# EAGLE schematic dacLayerBoard3 (EAGLE 6.1)
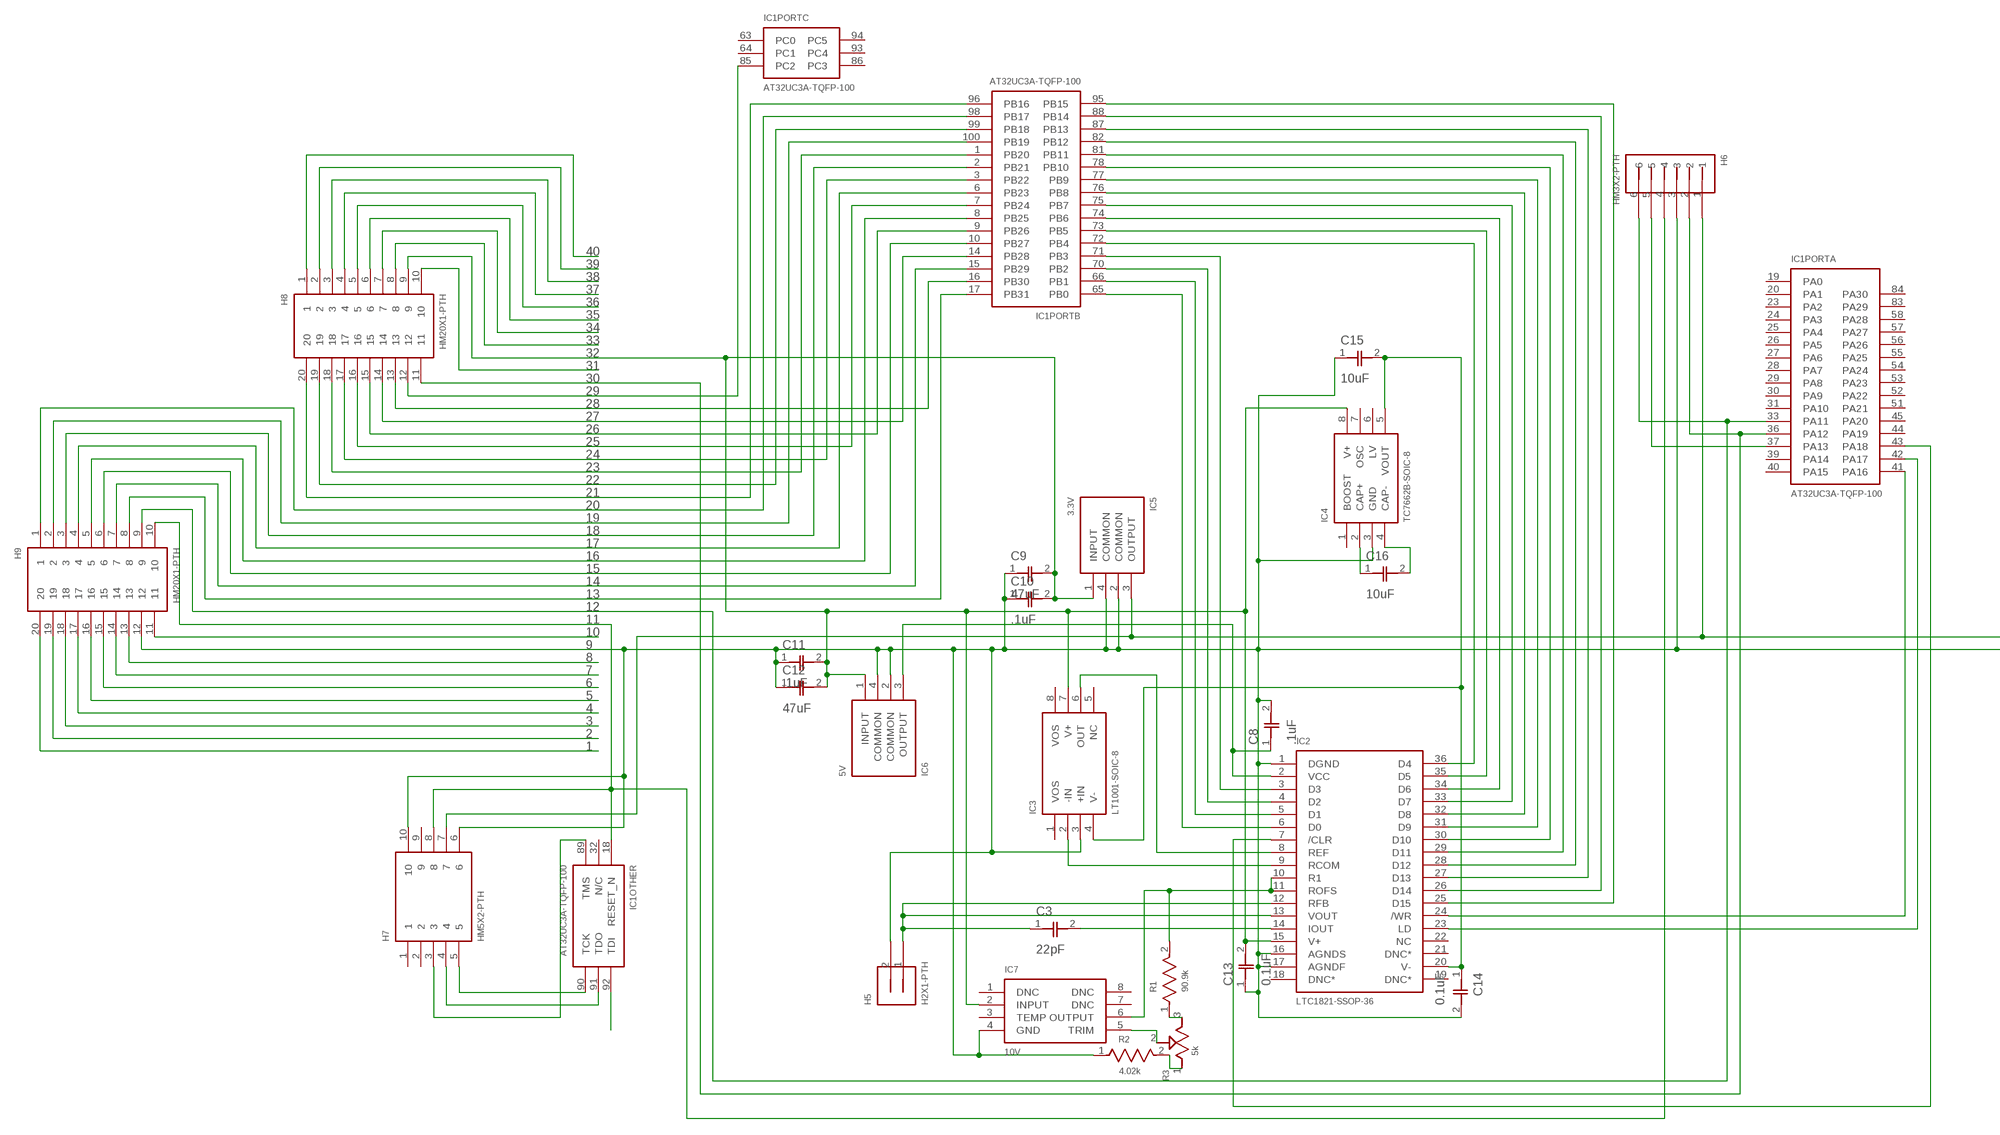
[diagram p0: schematic, sheet 1, part 1 of 2]
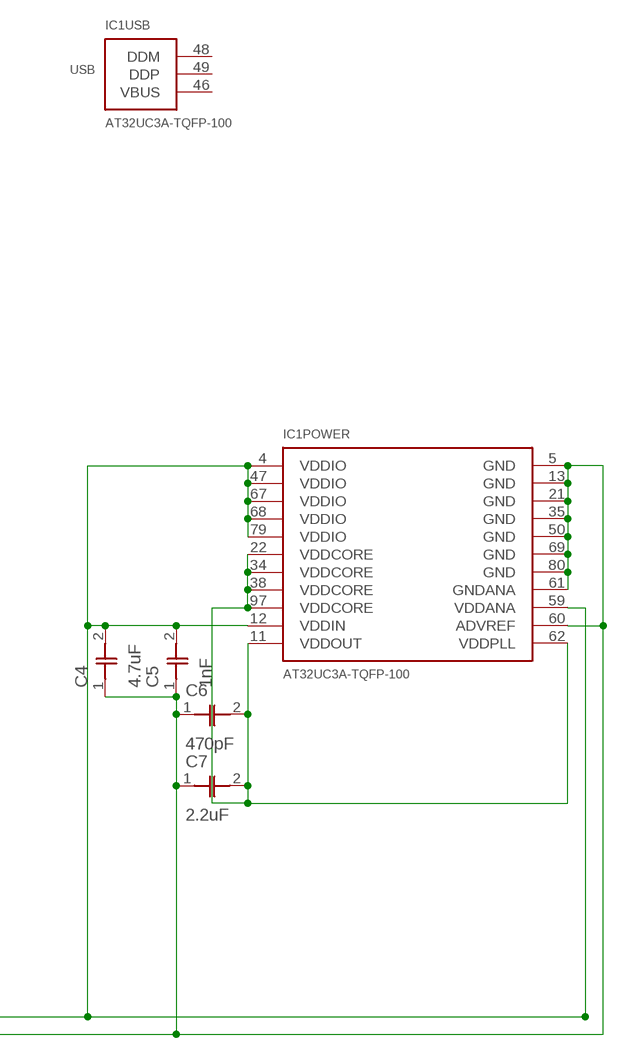
[diagram p1: schematic, sheet 1, part 2 of 2]

## Parts
C3  22pF  CAP-0603  [CAP-0603]
C4  4.7uF  CAP-0603  [CAP-0603]
C5  1nF  CAP-0603  [CAP-0603]
C6  470pF  CAP-0603  [CAP-0603]
C7  2.2uF  CAP-0603  [CAP-0603]
C8  .1uF  CAP-0603  [CAP-0603]
C9  47uF  CAP-0603  [CAP-0603]
C10  .1uF  CAP-0603  [CAP-0603]
C11  .1uF  CAP-0603  [CAP-0603]
C12  47uF  CAP-0603  [CAP-0603]
C13  0.1uF  CAP-0603  [CAP-0603]
C14  0.1uF  CAP-0603  [CAP-0603]
C15  10uF  CAP-0805  [0805]
C16  10uF  CAP-0805  [0805]
H5  H2X1-PTH  [HM2X1-PTH]
H6  HM3X2-PTH  [HM3X2-PTH]
H7  HM5X2-PTH  [HM5X2-PTH]
H8  HM20X1-PTH  [HM20X1-PTH]
H9  HM20X1-PTH  [HM20X1-PTH]
IC1  AT32UC3A-TQFP-100  [TQFP-100]
IC2  LTC1821-SSOP-36  [SSOP-36]
IC3  LT1001-SOIC-8  [SOIC-8]
IC4  TC7662B-SOIC-8  [SOIC-8]
IC5  3.3V  UA78M-SOT-223-4  [SOT-223-4]
IC6  5V  UA78M-SOT-223-4  [SOT-223-4]
IC7  10V  LT1019-SOIC-8  [SOIC-8]
R1  90.9k  RESISTOR-0603  [RES-0603]
R2  4.02k  RESISTOR-0603  [RES-0603]
R3  5k  TRIMPOT-3303W  [3303W]

## Nets
1: H9.20
2: H9.19
3: H9.18
4: H9.17
5: H9.16
6: H9.15
7: H9.14
8: H9.13
9: C4.1 C5.1 C6.1 C7.1 C8.2 C9.1 C10.1 C11.1 C12.1 C13.1 C14.2 C15.1 H5.2 H6.3 H7.6 H7.10 H9.12 IC1.5(POWER:GND) IC1.13(POWER:GND) IC1.21(POWER:GND) IC1.35(POWER:GND) IC1.50(POWER:GND) IC1.60(POWER:ADVREF) IC1.61(POWER:GNDANA) IC1.69(POWER:GND) IC1.80(POWER:GND) IC2.1(DGND) IC2.16(AGNDS) IC2.17(AGNDF) IC3.3(+IN) IC4.3(GND) IC5.2(COMMON) IC5.4(COMMON) IC6.2(COMMON) IC6.4(COMMON) IC7.4(GND) R2.1
10: H9.11
11: H6.4 H7.8 H9.10 IC1.18(OTHER:RESET_N)
12: H6.6 H9.9 IC1.33(PORTA:PA11)
13: H9.8 IC1.17(PORTB:PB31)
14: H9.7 IC1.15(PORTB:PB29)
15: H9.6 IC1.10(PORTB:PB27)
16: H9.5 IC1.8(PORTB:PB25)
17: H9.4 IC1.6(PORTB:PB23)
18: H9.3 IC1.2(PORTB:PB21)
19: H9.2 IC1.100(PORTB:PB19)
20: H9.1 IC1.98(PORTB:PB17)
21: H8.20 IC1.96(PORTB:PB16)
22: H8.19 IC1.99(PORTB:PB18)
23: H8.18 IC1.1(PORTB:PB20)
24: H8.17 IC1.3(PORTB:PB22)
25: H8.16 IC1.7(PORTB:PB24)
26: H8.15 IC1.9(PORTB:PB26)
27: H8.14 IC1.14(PORTB:PB28)
28: H8.13 IC1.16(PORTB:PB30)
29: H8.12 IC1.85(PORTC:PC2)
30: H6.2 H8.11 IC1.36(PORTA:PA12)
31: H8.10
32: C9.2 C10.2 C11.2 C12.2 C13.2 H8.9 IC2.15(V+) IC3.7(V+) IC4.8(V+) IC5.1(INPUT) IC6.1(INPUT) IC7.2(INPUT)
33: H8.8
34: H8.7
35: H8.6
36: H8.5
37: H8.4
38: H8.3
39: H8.2
40: H8.1
N$1: IC2.9(RCOM) IC3.2(-IN)
N$2: C8.1 IC2.2(VCC) IC6.3(OUTPUT)
N$3: IC2.8(REF) IC3.6(OUT)
N$4: C3.1 H5.1 IC2.12(RFB) IC2.13(VOUT)
N$5: C3.2 IC2.14(IOUT)
N$6: C16.1 IC4.2(CAP+)
N$7: C16.2 IC4.4(CAP-)
N$8: C4.2 C5.2 H6.1 H7.7 IC1.4(POWER:VDDIO) IC1.12(POWER:VDDIN) IC1.47(POWER:VDDIO) IC1.59(POWER:VDDANA) IC1.67(POWER:VDDIO) IC1.68(POWER:VDDIO) IC1.79(POWER:VDDIO) IC5.3(OUTPUT)
N$9: C6.2 C7.2 IC1.11(POWER:VDDOUT) IC1.22(POWER:VDDCORE) IC1.34(POWER:VDDCORE) IC1.38(POWER:VDDCORE) IC1.62(POWER:VDDPLL) IC1.97(POWER:VDDCORE)
N$10: C14.1 C15.2 IC2.20(V-) IC3.4(V-) IC4.5(VOUT)
N$11: IC1.65(PORTB:PB0) IC2.6(D0)
N$12: IC1.66(PORTB:PB1) IC2.5(D1)
N$13: IC1.70(PORTB:PB2) IC2.4(D2)
N$14: IC1.71(PORTB:PB3) IC2.3(D3)
N$15: IC1.72(PORTB:PB4) IC2.36(D4)
N$16: IC1.73(PORTB:PB5) IC2.35(D5)
N$17: IC1.74(PORTB:PB6) IC2.34(D6)
N$18: IC1.75(PORTB:PB7) IC2.33(D7)
N$19: IC1.76(PORTB:PB8) IC2.32(D8)
N$20: IC1.77(PORTB:PB9) IC2.31(D9)
N$21: IC1.78(PORTB:PB10) IC2.30(D10)
N$22: IC1.81(PORTB:PB11) IC2.29(D11)
N$23: IC1.82(PORTB:PB12) IC2.28(D12)
N$24: IC1.87(PORTB:PB13) IC2.27(D13)
N$25: IC1.88(PORTB:PB14) IC2.26(D14)
N$26: IC1.95(PORTB:PB15) IC2.25(D15)
N$27: IC1.41(PORTA:PA16) IC2.24(/WR)
N$28: IC1.42(PORTA:PA17) IC2.23(LD)
N$29: IC1.43(PORTA:PA18) IC2.7(/CLR)
N$30: IC2.10(R1) IC2.11(ROFS) IC7.6(OUTPUT) R1.2
N$31: IC7.5(TRIM) R3.2
N$32: R1.1 R3.3
N$33: R2.2 R3.1
N$34: H7.5 IC1.90(OTHER:TCK)
N$35: H7.4 IC1.91(OTHER:TDO)
N$36: H7.3 IC1.89(OTHER:TMS)
N$37: IC1.92(OTHER:TDI)
N$39: H6.5 IC1.37(PORTA:PA13)
Unconnected: H7.1 H7.2 H7.9 IC1.19(PORTA:PA0) IC1.20(PORTA:PA1) IC1.23(PORTA:PA2) IC1.24(PORTA:PA3) IC1.25(PORTA:PA4) IC1.26(PORTA:PA5) IC1.27(PORTA:PA6) IC1.28(PORTA:PA7) IC1.29(PORTA:PA8) IC1.30(PORTA:PA9) IC1.31(PORTA:PA10) IC1.32(OTHER:N/C) IC1.39(PORTA:PA14) IC1.40(PORTA:PA15) IC1.44(PORTA:PA19) IC1.45(PORTA:PA20) IC1.46(USB:VBUS) IC1.48(USB:DDM) IC1.49(USB:DDP) IC1.51(PORTA:PA21) IC1.52(PORTA:PA22) IC1.53(PORTA:PA23) IC1.54(PORTA:PA24) IC1.55(PORTA:PA25) IC1.56(PORTA:PA26) IC1.57(PORTA:PA27) IC1.58(PORTA:PA28) IC1.63(PORTC:PC0) IC1.64(PORTC:PC1) IC1.83(PORTA:PA29) IC1.84(PORTA:PA30) IC1.86(PORTC:PC3) IC1.93(PORTC:PC4) IC1.94(PORTC:PC5) IC2.18(DNC*) IC2.19(DNC*) IC2.21(DNC*) IC2.22(NC) IC3.1(VOS) IC3.5(NC) IC3.8(VOS) IC4.1(BOOST) IC4.6(LV) IC4.7(OSC) IC7.1(DNC) IC7.3(TEMP) IC7.7(DNC) IC7.8(DNC)

## Library data of the parts
C3-C16 = july13b:CAP
H5 = august24:H2X1
H6 = august24:HM3X2
H7 = august24:HM5X2
H8 H9 = august24:HM20X1
IC1 = july13b:AT32UC3A
IC2 = july13b:LTC1821
IC3 = july13b:LT1001
IC4 = july13b:TC7662B
IC5 IC6 = july13b:UA78M*
IC7 = july13b:LT1019
R1 R2 = july13b:RESISTOR
R3 = july13b:TRIMPOT